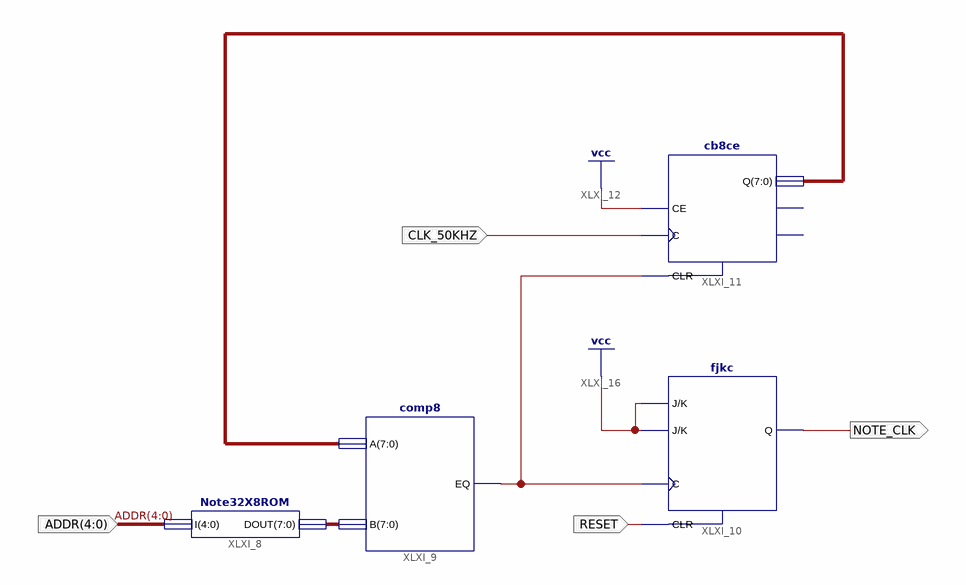
[diagram p0: schematic sheet 1]
// Xilinx ISE schematic Note_CLK_GEN.sch (spartan6) as structural Verilog: 4 symbols, 4 ports
module Note_CLK_GEN (
  input  [4:0] ADDR,
  input  RESET,
  input  CLK_50KHZ,
  output NOTE_CLK
);

  wire XLXN_12;
  wire [7:0] XLXN_14;
  wire [31:0] XLXN_4;

  Note32X8ROM XLXI_8 (.I(ADDR), .DOUT(XLXN_4));
  comp8 XLXI_9 (.A(XLXN_14), .B(XLXN_4), .EQ(XLXN_12));
  fjkc XLXI_10 (.C(XLXN_12), .CLR(RESET), .J(1'b1), .K(1'b1), .Q(NOTE_CLK));
  cb8ce XLXI_11 (.C(CLK_50KHZ), .CE(1'b1), .CLR(XLXN_12), .Q(XLXN_14));  // open: CEO, TC
endmodule
